# EAGLE design WithoutBypassCap (EAGLE 9.2.2)
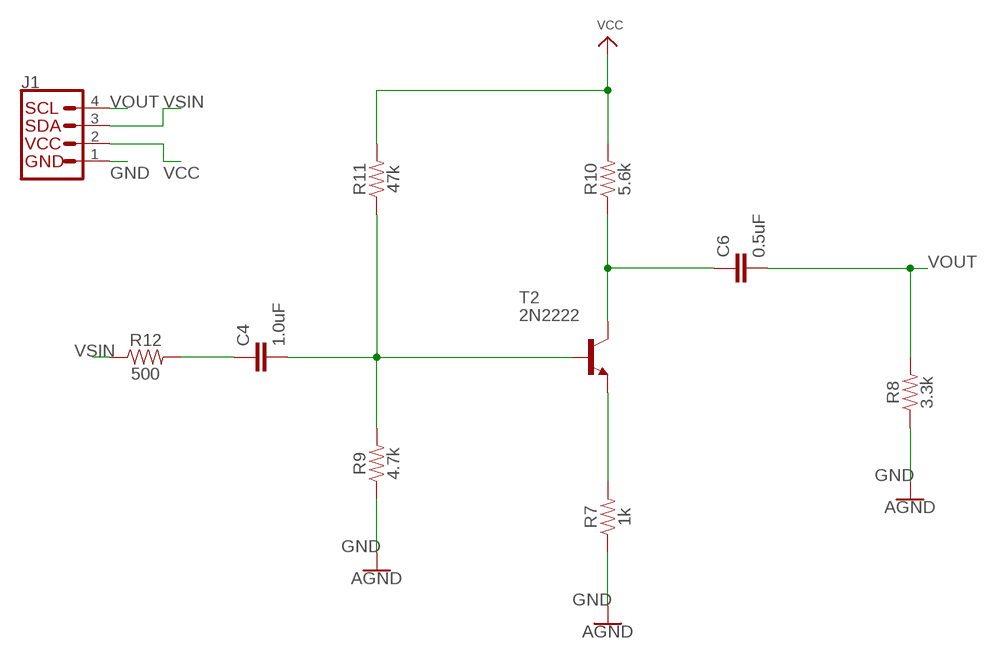
[diagram p0: schematic, sheet 1]

## Parts
C4  1.0uF  1.0UF-0603-16V-10%  [0603]
C6  0.5uF  1.0UF-0603-16V-10%  [0603]
J1  QWIIC_CONNECTORJS-1MM  [1X04_1MM_RA]
R7  1k  1KOHM-0603-1/10W-1%  [0603]
R8  3.3k  3.3KOHM-0603-1/10W-1%  [0603]
R9  4.7k  4.7KOHM-0603-1/10W-1%  [0603]
R10  5.6k  5.6KOHM-0603-1/10W-1%  [0603]
R11  47k  47KOHM-0603-1/10W-1%  [0603]
R12  500  300OHM-0603-1/10W-1%  [0603]
T2  2N2222  [TO92-EBC-OVAL]

## Nets
GND: J1.1(GND) R7.1 R8.1 R9.1 ; supply symbol labelled AGND
N$2: C6.1 R10.1 T2.C
N$5: R7.2 T2.E
N$7: C4.2 R9.2 R11.1 T2.B
N$8: C4.1 R12.2
VCC: J1.2(VCC) R10.2 R11.2
VOUT: C6.2 J1.4(SCL) R8.2
VSIN: J1.3(SDA) R12.1

## Library data of the parts
C4 = SparkFun-Capacitors:1.0UF: 1µF ceramic capacitors A capacitor is a passive two-terminal electrical component used to store electrical energy temporarily in an electric field.; PROD_ID: CAP-00868
C6 = SparkFun-Capacitors:1.0UF: 1µF ceramic capacitors A capacitor is a passive two-terminal electrical component used to store electrical energy temporarily in an electric field.; PROD_ID: CAP-00868; VALUE: 1.0uF
J1 = SparkFun-Connectors:QWIIC_CONNECTOR: SparkFun I2C Standard Qwiic Connector An SMD 1mm pitch JST connector makes it easy and quick (get it? Qwiic?) to connect I2C devices to each other. The Qwiic system <http://www.sparkfun.com/qwiic> enables fast and solderless connection between popular platforms and various sensors and actuators. We carry 200mm <https://www.sparkfun.com/products/14204>, 100mm <https://www.sparkfun.com/products/14205>, 50mm <https://www.sparkfun.com/products/14206>, and breadboard friendly <https://www.sparkfun.com/products/14207> Qwiic cables. We also offer 10 pcs strips <https://www.sparkfun.com/products/14323> the SMD connectors.
R7 = SparkFun-Resistors:1KOHM: 1kΩ resistor A resistor is a passive two-terminal electrical component that implements electrical resistance as a circuit element. Resistors act to reduce current flow, and, at the same time, act to lower voltage levels within circuits. - Wikipedia; PROD_ID: RES-07856
R8 = SparkFun-Resistors:3.3KOHM: 3.3kΩ resistor A resistor is a passive two-terminal electrical component that implements electrical resistance as a circuit element. Resistors act to reduce current flow, and, at the same time, act to lower voltage levels within circuits. - Wikipedia; PROD_ID: RES-07851
R9 = SparkFun-Resistors:4.7KOHM: 4.7kΩ resistor A resistor is a passive two-terminal electrical component that implements electrical resistance as a circuit element. Resistors act to reduce current flow, and, at the same time, act to lower voltage levels within circuits. - Wikipedia; PROD_ID: RES-07857
R10 = SparkFun-Resistors:5.6KOHM: 5.6kΩ resistor A resistor is a passive two-terminal electrical component that implements electrical resistance as a circuit element. Resistors act to reduce current flow, and, at the same time, act to lower voltage levels within circuits. - Wikipedia; PROD_ID: RES-12378
R11 = SparkFun-Resistors:47KOHM: 47kΩ resistor A resistor is a passive two-terminal electrical component that implements electrical resistance as a circuit element. Resistors act to reduce current flow, and, at the same time, act to lower voltage levels within circuits. - Wikipedia; PROD_ID: RES-07871
R12 = SparkFun-Resistors:300OHM: 300Ω resistor A resistor is a passive two-terminal electrical component that implements electrical resistance as a circuit element. Resistors act to reduce current flow, and, at the same time, act to lower voltage levels within circuits. - Wikipedia; PROD_ID: RES_10328; VALUE: 300
T2 = adafruit:2N2222: NPN TRANSISTOR Big oval pads

## Board
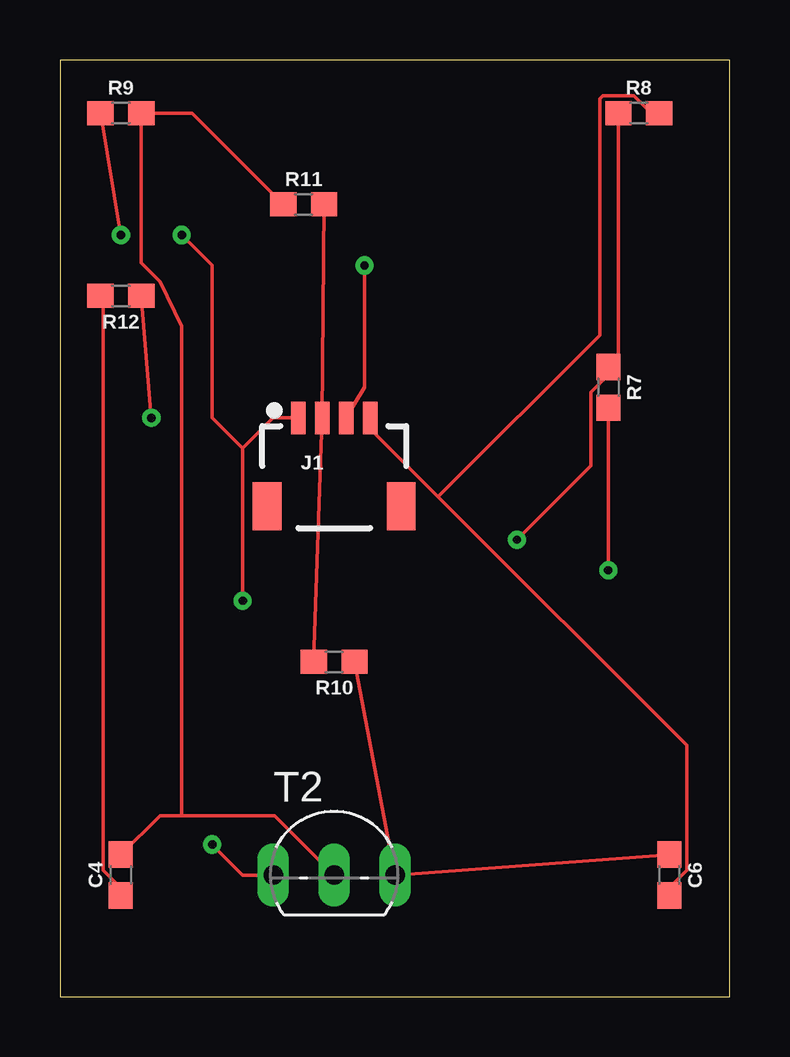
[diagram p1: board, top side]
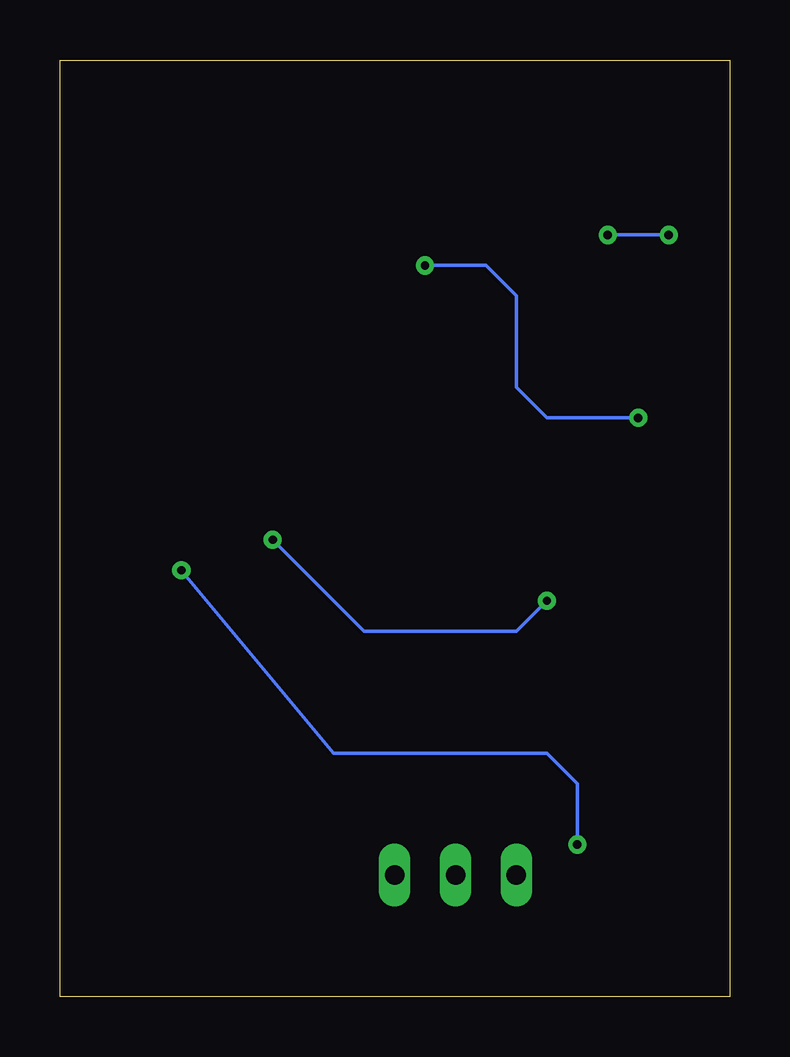
[diagram p2: board, bottom side, seen from below]

Size 27.92 x 39.04 mm. Coordinates in mm from the lower left corner, seen from the top.
Outline: 0,0 27.92,0 27.92,39.04 0,39.04 0,0
Copper layers (1*16): Top 0.035mm / dielectric 1.5mm / Bottom 0.035mm
Design rules "default": minimum track width 6mil, minimum drill 0.35mm, track to track 6mil, track to pad 6mil, pad to pad 6mil, via to via 6mil, smd to smd 6mil, copper to edge 40mil, drill to drill 6mil, minimum pad ring 10mil, minimum via ring 8mil, stop-mask expansion 4mil, vias tented up to drill 0mil, thermal gap 10mil

### Footprints (pad centres in the part's own frame; a part is rotated, then mirrored left to right if it is on the bottom)
0603 = smd 1.1 x 1: 1 -0.85,0; 2 0.85,0
1X04_1MM_RA = smd 0.6 x 1.35: 1 -1.5,0; 2 -0.5,0; 3 0.5,0; 4 1.5,0 | smd 1.2 x 2: NC1 2.8,-3.675; NC2 -2.8,-3.675
TO92-EBC-OVAL = drill 0.813 long: B 0,-1.27; C 2.54,-1.27; E -2.54,-1.27

### Placement (x,y rotation side)
C4  2.54,5.08 90 top
C6  25.4,5.08 270 top
J1  11.43,24.13 0 top
R7  22.86,25.4 270 top
R8  24.13,36.83 0 top
R9  2.54,36.83 0 top
R10  11.43,13.97 180 top
R11  10.16,33.02 0 top
R12  2.54,29.21 180 top
T2  11.43,6.35 0 top

### Tracks (layer width: path | path; a pad name or v marks a point on that pad's centre or on a via)
GND  (via drill 0.35)
  Top 0.152: R8.1 23.28,26.67 R7.1 22.86,25.92 22.13,25.2 22.13,22.13 v19.05,19.05 | v7.62,16.51 7.62,22.86 | 7.62,22.86 8.89,24.13 J1.1 | R9.1 v2.54,31.75 | v5.08,31.75 6.35,30.48 6.35,24.13 7.62,22.86
  Bottom 0.152: v19.05,19.05 15.24,15.24 8.89,15.24 v7.62,16.51 | v2.54,31.75 v5.08,31.75
N$2
  Top 0.152: C6.1 T2.C R10.1
N$5  (via drill 0.35)
  Top 0.152: R7.2 v22.86,17.78 | v6.35,6.35 7.62,5.08 T2.E
  Bottom 0.152: v22.86,17.78 16.51,10.16 7.62,10.16 6.35,8.89 v6.35,6.35
N$7
  Top 0.152: C4.2 4.17,7.56 5.08,7.56 | 5.08,7.56 8.95,7.56 T2.B | R11.1 5.5,36.83 R9.2 3.39,30.58 4.17,29.8 5.08,27.94 5.08,7.56
N$8
  Top 0.152: C4.1 2.54,4.56 1.81,5.29 1.81,29.09 R12.2
VCC
  Top 0.152: R11.2 J1.2 | J1.2 | R10.2 J1.2
VOUT
  Top 0.152: R8.2 24.65,36.83 23.93,37.56 22.64,37.56 22.5,37.42 22.5,27.58 15.76,20.84 | C6.2 25.4,4.56 26.13,5.29 26.13,10.48 15.76,20.84 | J1.4 12.93,23.68 15.76,20.84
VSIN  (via drill 0.35)
  Top 0.152: v12.7,30.48 12.7,29.21 12.7,25.4 J1.3 | R12.1 v3.81,24.13
  Bottom 0.152: v12.7,30.48 10.16,30.48 8.89,29.21 8.89,25.4 7.62,24.13 v3.81,24.13